# Altium schematic sheet [04] - COMe CONNECTOR.SchDoc
size A2; Organization: Altium Limited; Address1: L3, 12a Rodborough Rd; Address2: Frenchs Forest; Address3: NSW; Address4: Australia 2086; DocumentNumber: 4; SheetNumber: 4; SheetTotal: 11
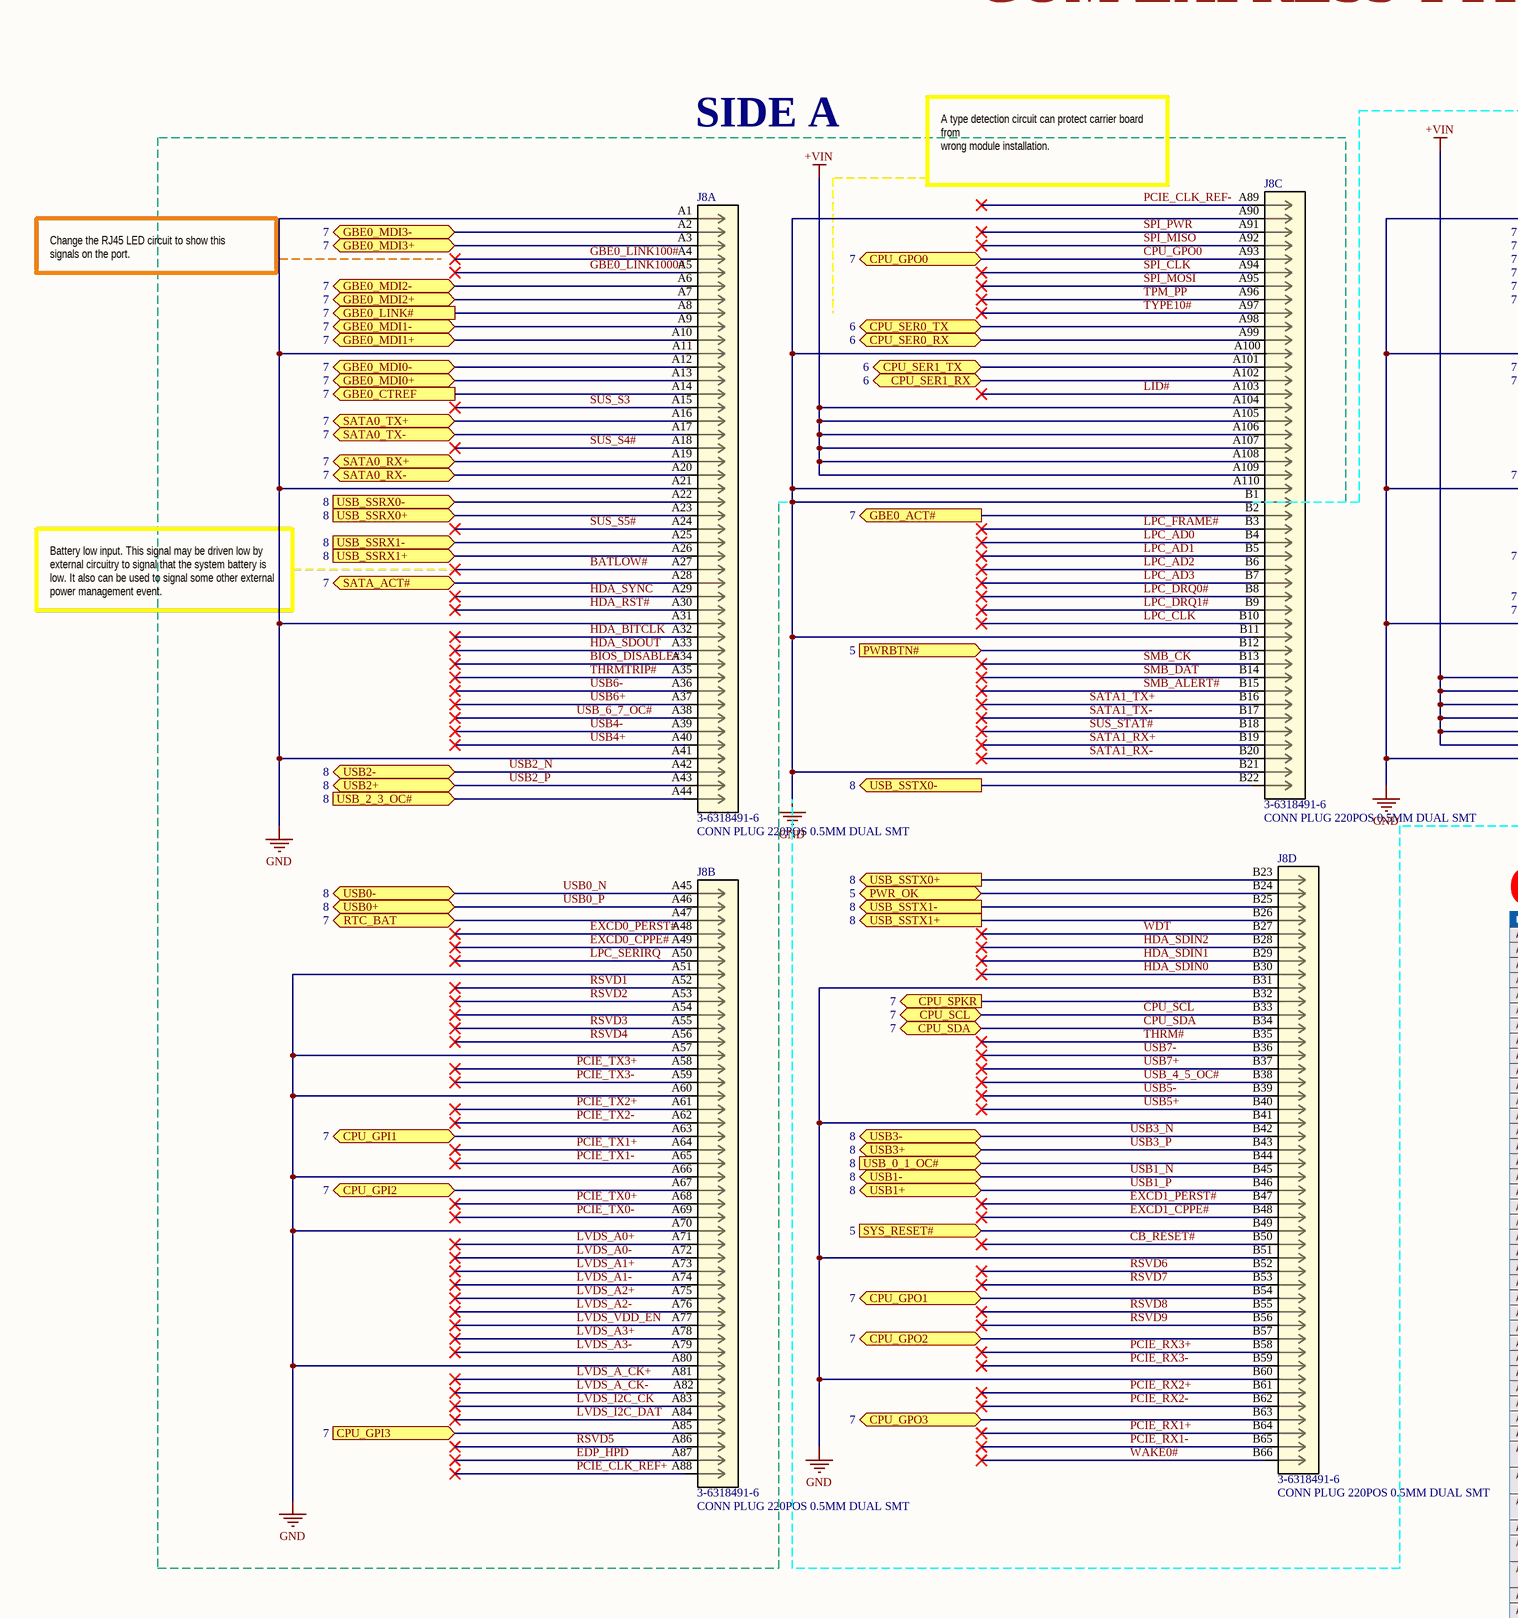
[diagram p0: [04] - COMe CONNECTOR.SchDoc, left]
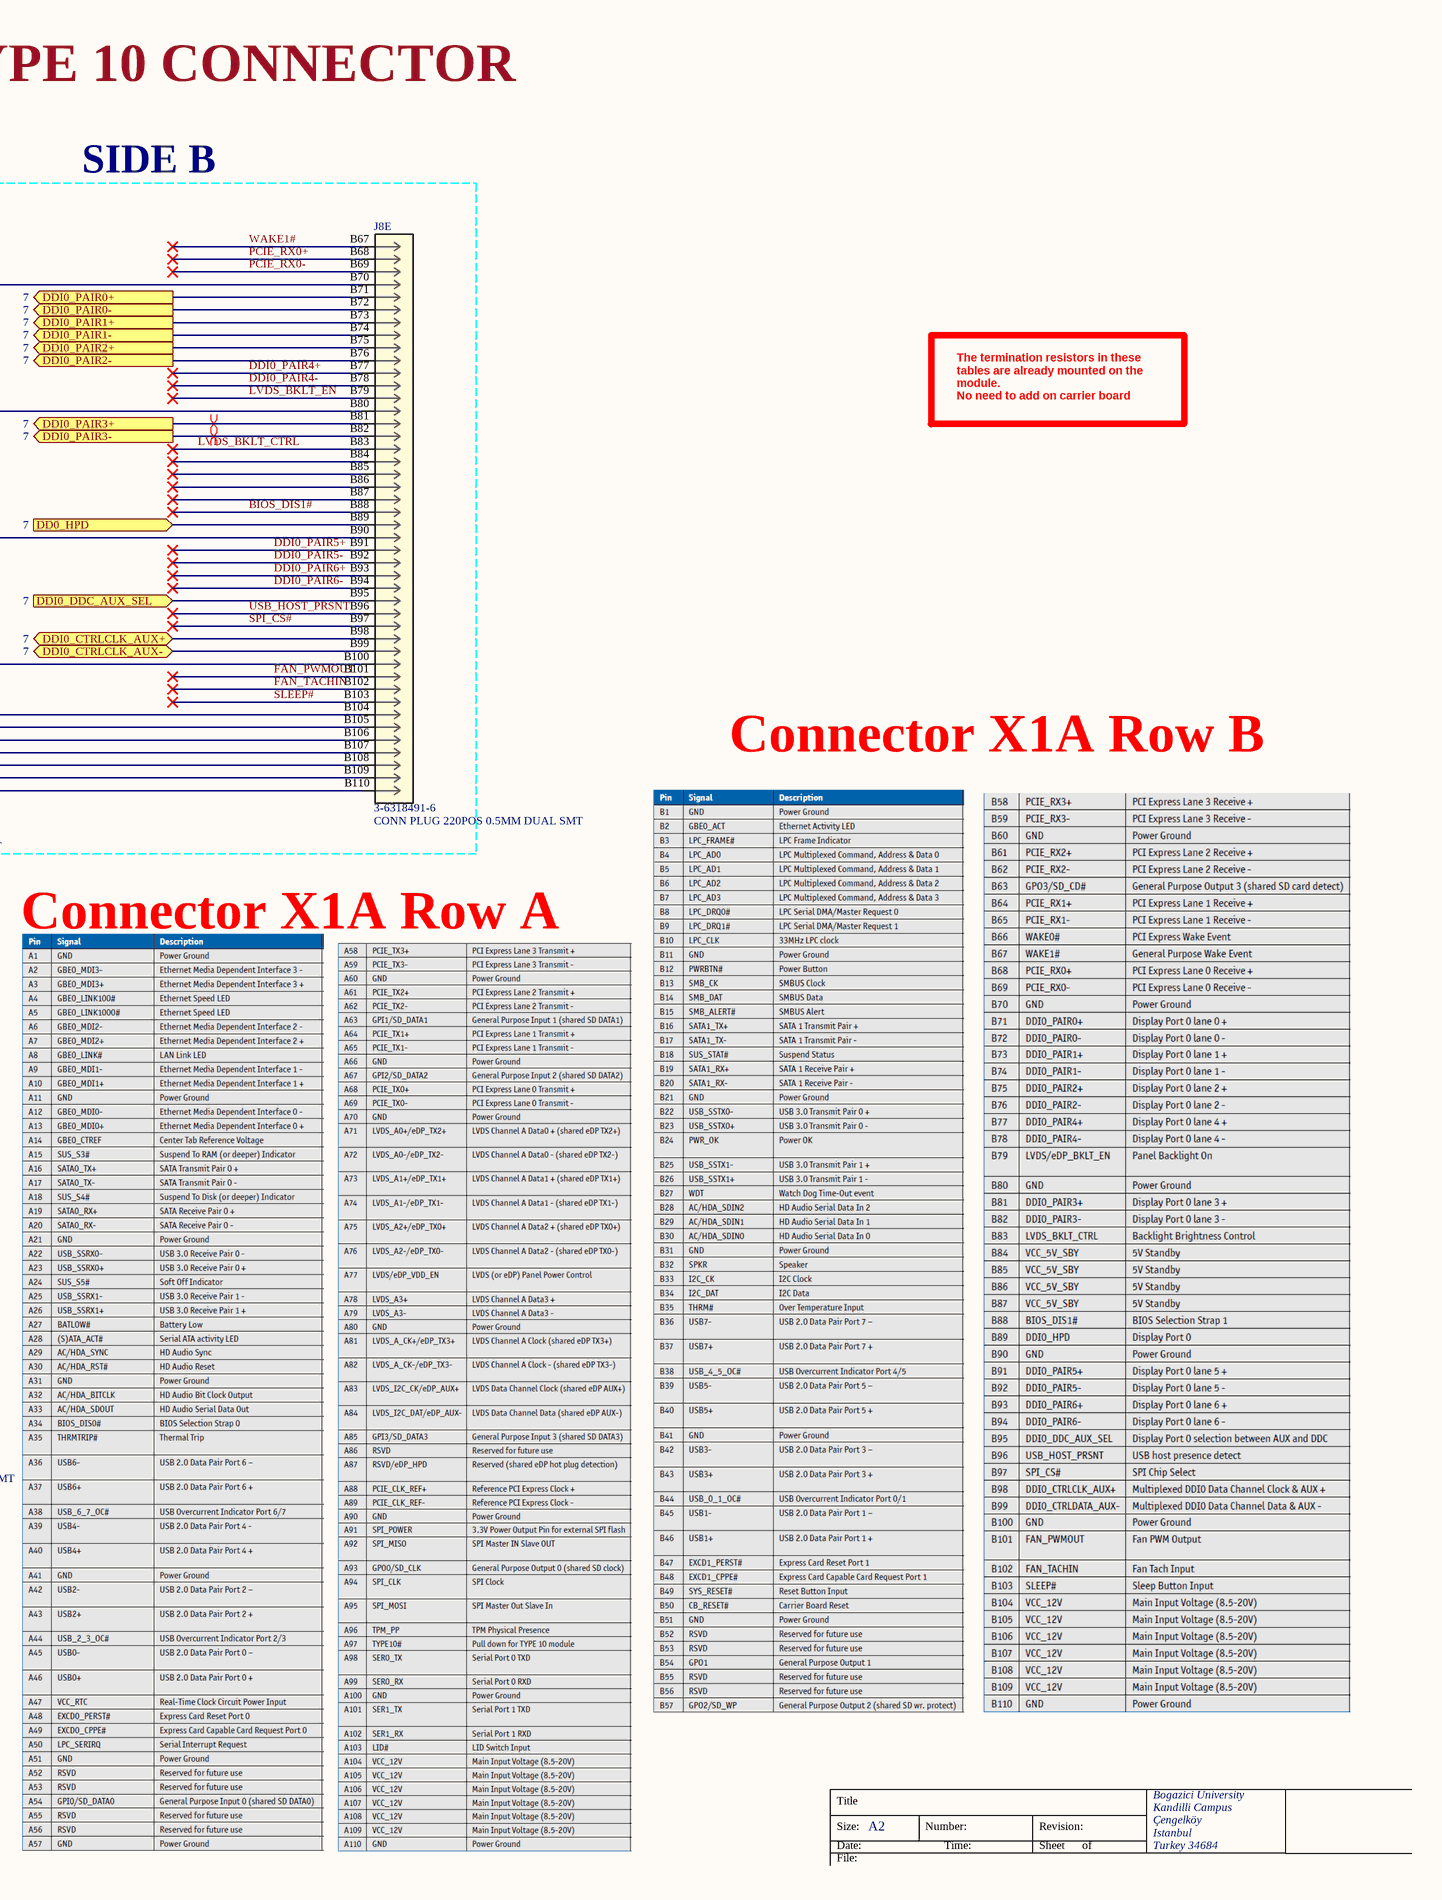
[diagram p1: [04] - COMe CONNECTOR.SchDoc, right]

## Parts
J8  3-6318491-6  [CONN220_3-631849 - WM]  (parts A,B,C,D,E of 5)

## Blocks framed on the sheet
SIDE A: J8

## Ports
CPU_GPI1 (bidir, see 7), CPU_GPI2 (bidir, see 7), CPU_GPI3 (in, see 7), CPU_GPO0 (bidir, see 7), CPU_GPO1 (bidir, see 7), CPU_GPO2 (bidir, see 7), CPU_GPO3 (bidir, see 7), CPU_SCL (bidir, see 7), CPU_SDA (bidir, see 7), CPU_SER0_RX (bidir, see 6), CPU_SER0_TX (bidir, see 6), CPU_SER1_RX (bidir, see 6), CPU_SER1_TX (bidir, see 6), CPU_SPKR (out, see 7), DD0_HPD (in, see 7), DDI0_CTRLCLK_AUX+ (bidir, see 7), DDI0_CTRLCLK_AUX- (bidir, see 7), DDI0_DDC_AUX_SEL (in, see 7), DDI0_PAIR0+ (out, see 7), DDI0_PAIR0- (out, see 7), DDI0_PAIR1+ (out, see 7), DDI0_PAIR1- (out, see 7), DDI0_PAIR2+ (out, see 7), DDI0_PAIR2- (out, see 7), DDI0_PAIR3+ (out, see 7), DDI0_PAIR3- (out, see 7), GBE0_ACT# (out, see 7), GBE0_CTREF (out, see 7), GBE0_LINK# (out, see 7), GBE0_MDI0+ (bidir, see 7), GBE0_MDI0- (bidir, see 7), GBE0_MDI1+ (bidir, see 7), GBE0_MDI1- (bidir, see 7), GBE0_MDI2+ (bidir, see 7), GBE0_MDI2- (bidir, see 7), GBE0_MDI3+ (bidir, see 7), GBE0_MDI3- (bidir, see 7), PWR_OK (bidir, see 5), PWRBTN# (in, see 5), RTC_BAT (bidir, see 7), SATA0_RX+ (bidir, see 7), SATA0_RX- (bidir, see 7), SATA0_TX+ (bidir, see 7), SATA0_TX- (bidir, see 7), SATA_ACT# (bidir, see 7), SYS_RESET# (in, see 5), USB0+ (bidir, see 8), USB0- (bidir, see 8), USB1+ (bidir, see 8), USB1- (bidir, see 8), USB2+ (bidir, see 8), USB2- (bidir, see 8), USB3+ (bidir, see 8), USB3- (bidir, see 8), USB_0_1_OC# (in, see 8), USB_2_3_OC# (in, see 8), USB_SSRX0+ (in, see 8), USB_SSRX0- (in, see 8), USB_SSRX1+ (in, see 8), USB_SSRX1- (in, see 8), USB_SSTX0+ (out, see 8), USB_SSTX0- (out, see 8), USB_SSTX1+ (out, see 8), USB_SSTX1- (out, see 8)

## Nets
+VIN: J8.A104 J8.A105 J8.A106 J8.A107 J8.A108 J8.A109 J8.B104 J8.B105 J8.B106 J8.B107 J8.B108 J8.B109
GND: J8.A1 J8.A11 J8.A21 J8.A31 J8.A41 J8.A51 J8.A57 J8.A60 J8.A66 J8.A70 J8.A80 J8.A90 J8.A110 J8.B1 J8.B11 J8.B21 J8.B31 J8.B41 J8.B51 J8.B60 J8.B70 J8.B80 J8.B90 J8.B100 J8.B110
BATLOW#: J8.A27
BIOS_DIS1#: J8.B88
BIOS_DISABLE#: J8.A34
CB_RESET#: J8.B50
CPU_GPI1: J8.A63 ; port CPU_GPI1
CPU_GPI2: J8.A67 ; port CPU_GPI2
CPU_GPI3: J8.A85 ; port CPU_GPI3
CPU_GPO0: J8.A93 ; port CPU_GPO0
CPU_GPO1: J8.B54 ; port CPU_GPO1
CPU_GPO2: J8.B57 ; port CPU_GPO2
CPU_GPO3: J8.B63 ; port CPU_GPO3
CPU_SCL: J8.B33 ; port CPU_SCL
CPU_SDA: J8.B34 ; port CPU_SDA
CPU_SER0_RX: J8.A99 ; port CPU_SER0_RX
CPU_SER0_TX: J8.A98 ; port CPU_SER0_TX
CPU_SER1_RX: J8.A102 ; port CPU_SER1_RX
CPU_SER1_TX: J8.A101 ; port CPU_SER1_TX
CPU_SPKR: J8.B32 ; port CPU_SPKR
DD0_HPD: J8.B89 ; port DD0_HPD
DDI0_CTRLCLK_AUX+: J8.B98 ; port DDI0_CTRLCLK_AUX+
DDI0_CTRLCLK_AUX-: J8.B99 ; port DDI0_CTRLCLK_AUX-
DDI0_DDC_AUX_SEL: J8.B95 ; port DDI0_DDC_AUX_SEL
DDI0_PAIR0+: J8.B71 ; port DDI0_PAIR0+
DDI0_PAIR0-: J8.B72 ; port DDI0_PAIR0-
DDI0_PAIR1+: J8.B73 ; port DDI0_PAIR1+
DDI0_PAIR1-: J8.B74 ; port DDI0_PAIR1-
DDI0_PAIR2+: J8.B75 ; port DDI0_PAIR2+
DDI0_PAIR2-: J8.B76 ; port DDI0_PAIR2-
DDI0_PAIR3+: J8.B81 ; port DDI0_PAIR3+
DDI0_PAIR3-: J8.B82 ; port DDI0_PAIR3-
DDI0_PAIR4+: J8.B77
DDI0_PAIR4-: J8.B78
DDI0_PAIR5+: J8.B91
DDI0_PAIR5-: J8.B92
DDI0_PAIR6+: J8.B93
DDI0_PAIR6-: J8.B94
EDP_HPD: J8.A87
EXCD0_CPPE#: J8.A49
EXCD0_PERST#: J8.A48
EXCD1_CPPE#: J8.B48
EXCD1_PERST#: J8.B47
FAN_PWMOUT: J8.B101
FAN_TACHIN: J8.B102
GBE0_ACT#: J8.B2 ; port GBE0_ACT#
GBE0_CTREF: J8.A14 ; port GBE0_CTREF
GBE0_LINK100#: J8.A4
GBE0_LINK1000#: J8.A5
GBE0_LINK#: J8.A8 ; port GBE0_LINK#
GBE0_MDI0+: J8.A13 ; port GBE0_MDI0+
GBE0_MDI0-: J8.A12 ; port GBE0_MDI0-
GBE0_MDI1+: J8.A10 ; port GBE0_MDI1+
GBE0_MDI1-: J8.A9 ; port GBE0_MDI1-
GBE0_MDI2+: J8.A7 ; port GBE0_MDI2+
GBE0_MDI2-: J8.A6 ; port GBE0_MDI2-
GBE0_MDI3+: J8.A3 ; port GBE0_MDI3+
GBE0_MDI3-: J8.A2 ; port GBE0_MDI3-
HDA_BITCLK: J8.A32
HDA_RST#: J8.A30
HDA_SDIN0: J8.B30
HDA_SDIN1: J8.B29
HDA_SDIN2: J8.B28
HDA_SDOUT: J8.A33
HDA_SYNC: J8.A29
LID#: J8.A103
LPC_AD0: J8.B4
LPC_AD1: J8.B5
LPC_AD2: J8.B6
LPC_AD3: J8.B7
LPC_CLK: J8.B10
LPC_DRQ0#: J8.B8
LPC_DRQ1#: J8.B9
LPC_FRAME#: J8.B3
LPC_SERIRQ: J8.A50
LVDS_A0+: J8.A71
LVDS_A0-: J8.A72
LVDS_A1+: J8.A73
LVDS_A1-: J8.A74
LVDS_A2+: J8.A75
LVDS_A2-: J8.A76
LVDS_A3+: J8.A78
LVDS_A3-: J8.A79
LVDS_A_CK+: J8.A81
LVDS_BKLT_CTRL: J8.B83
LVDS_BKLT_EN: J8.B79
LVDS_I2C_CK: J8.A83
LVDS_I2C_DAT: J8.A84
LVDS_VDD_EN: J8.A77
PCIE_CLK_REF+: J8.A88
PCIE_CLK_REF-: J8.A89
PCIE_RX0+: J8.B68
PCIE_RX0-: J8.B69
PCIE_RX1+: J8.B64
PCIE_RX1-: J8.B65
PCIE_RX2+: J8.B61
PCIE_RX2-: J8.B62
PCIE_RX3+: J8.B58
PCIE_RX3-: J8.B59
PCIE_TX0+: J8.A68
PCIE_TX0-: J8.A69
PCIE_TX1+: J8.A64
PCIE_TX1-: J8.A65
PCIE_TX2+: J8.A61
PCIE_TX2-: J8.A62
PCIE_TX3+: J8.A58
PCIE_TX3-: J8.A59
PWR_OK: J8.B24 ; port PWR_OK
PWRBTN#: J8.B12 ; port PWRBTN#
RSVD1: J8.A52
RSVD2: J8.A53
RSVD3: J8.A55
RSVD4: J8.A56
RSVD5: J8.A86
RSVD6: J8.B52
RSVD7: J8.B53
RSVD8: J8.B55
RSVD9: J8.B56
RTC_BAT: J8.A47 ; port RTC_BAT
SATA0_RX+: J8.A19 ; port SATA0_RX+
SATA0_RX-: J8.A20 ; port SATA0_RX-
SATA0_TX+: J8.A16 ; port SATA0_TX+
SATA0_TX-: J8.A17 ; port SATA0_TX-
SATA1_RX+: J8.B19
SATA1_RX-: J8.B20
SATA1_TX+: J8.B16
SATA1_TX-: J8.B17
SATA_ACT#: J8.A28 ; port SATA_ACT#
SLEEP#: J8.B103
SMB_ALERT#: J8.B15
SMB_CK: J8.B13
SMB_DAT: J8.B14
SPI_CLK: J8.A94
SPI_CS#: J8.B97
SPI_MISO: J8.A92
SPI_MOSI: J8.A95
SPI_PWR: J8.A91
SUS_S3: J8.A15
SUS_S4#: J8.A18
SUS_S5#: J8.A24
SUS_STAT#: J8.B18
SYS_RESET#: J8.B49 ; port SYS_RESET#
THRM#: J8.B35
THRMTRIP#: J8.A35
TPM_PP: J8.A96
TYPE10#: J8.A97
USB0_N: J8.A45 ; port USB0-
USB0_P: J8.A46 ; port USB0+
USB1_N: J8.B45 ; port USB1-
USB1_P: J8.B46 ; port USB1+
USB2_N: J8.A42 ; port USB2-
USB2_P: J8.A43 ; port USB2+
USB3_N: J8.B42 ; port USB3-
USB3_P: J8.B43 ; port USB3+
USB4+: J8.A40
USB4-: J8.A39
USB5+: J8.B40
USB5-: J8.B39
USB6+: J8.A37
USB6-: J8.A36
USB7+: J8.B37
USB7-: J8.B36
USB_0_1_OC#: J8.B44 ; port USB_0_1_OC#
USB_2_3_OC#: J8.A44 ; port USB_2_3_OC#
USB_4_5_OC#: J8.B38
USB_6_7_OC#: J8.A38
USB_HOST_PRSNT: J8.B96
USB_SSRX0+: J8.A23 ; port USB_SSRX0+
USB_SSRX0-: J8.A22 ; port USB_SSRX0-
USB_SSRX1+: J8.A26 ; port USB_SSRX1+
USB_SSRX1-: J8.A25 ; port USB_SSRX1-
USB_SSTX0+: J8.B23 ; port USB_SSTX0+
USB_SSTX0-: J8.B22 ; port USB_SSTX0-
USB_SSTX1+: J8.B26 ; port USB_SSTX1+
USB_SSTX1-: J8.B25 ; port USB_SSTX1-
WAKE0#: J8.B66
WAKE1#: J8.B67
WDT: J8.B27

Not connected (* = marked no-connect by the designer): J8 A54* A82 A100 B84* B85* B86* B87*

## Layout directives
differential pair; net class diff_HDMI: DDI0_PAIR3+, DDI0_PAIR3-

## Notes on the sheet
- COM EXPRESS TYPE 10 CONNECTOR
- SIDE B
- A type detection circuit can protect carrier board from
  wrong module installation.
- Change the RJ45 LED circuit to show this signals on the port.
- The termination resistors in these tables are already mounted on the module.
  No need to add on carrier board
- Battery low input. This signal may be driven low by
  external circuitry to signal that the system battery is
  low. It also can be used to signal some other external
  power management event.
- Connector X1A Row B
- Connector X1A Row A
- Title
- Bogazici University
- Size:
- Date:
- File:
- A2
- Number:
- Time:
- Revision:
- Sheet
- of
- Kandilli Campus
- Çengelköy
- Istanbul
- Turkey 34684

## Library data of the parts
J8 = 3-6318491-6: CONN PLUG 220POS 0.5MM DUAL SMT; Manufacturer 1: TE Connectivity AMP Connectors; Connector Type: Plug, Outer Shroud Contacts; Number of Positions: 220; Pitch: 0.020" (0.50mm); Mated Stacking Heights: 5mm, 8mm; Manufacturer Part Number 1: 3-6318491-6; RoHS: RoHS Compliant; Stock 1: 4181; Pricing 1: 1=18.41, 10=17.21, 30=15.60933, 60=15.209, 120=13.60792, 270=12.80748, 510=12.56737 (USD); Packaging: Tray; Part Status: Active; Mounting Type: Surface Mount; Features: Board Guide, Ground Plate; Contact Finish: Gold; Contact Finish Thickness: 8.00µin (0.203µm); Height Above Board: 0.293" (7.45mm); ComponentLink1URL: https://www.te.com/commerce/DocumentDelivery/DDEController?Action=srchrtrv&DocNm=6318491&DocType=Customer+Drawing&DocLang=English; ComponentLink1Description: https://www.te.com/commerce/DocumentDelivery/DDEController?Action=srchrtrv&DocNm=6318491&DocType=Customer+Drawing&DocLang=English; Supplier 1: Digi-Key; Supplier Part Number 1: A107335-ND; Category: Connectors, Interconnects; Description 1: CONN PLUG 220POS 0.5MM DUAL SMT